# Altium schematic sheet [13] TYPEC0_PROG.SchDoc: Type C Programmer
size B; DocumentNumber: I; Revision: 01; SheetNumber: 13; SheetTotal: 19
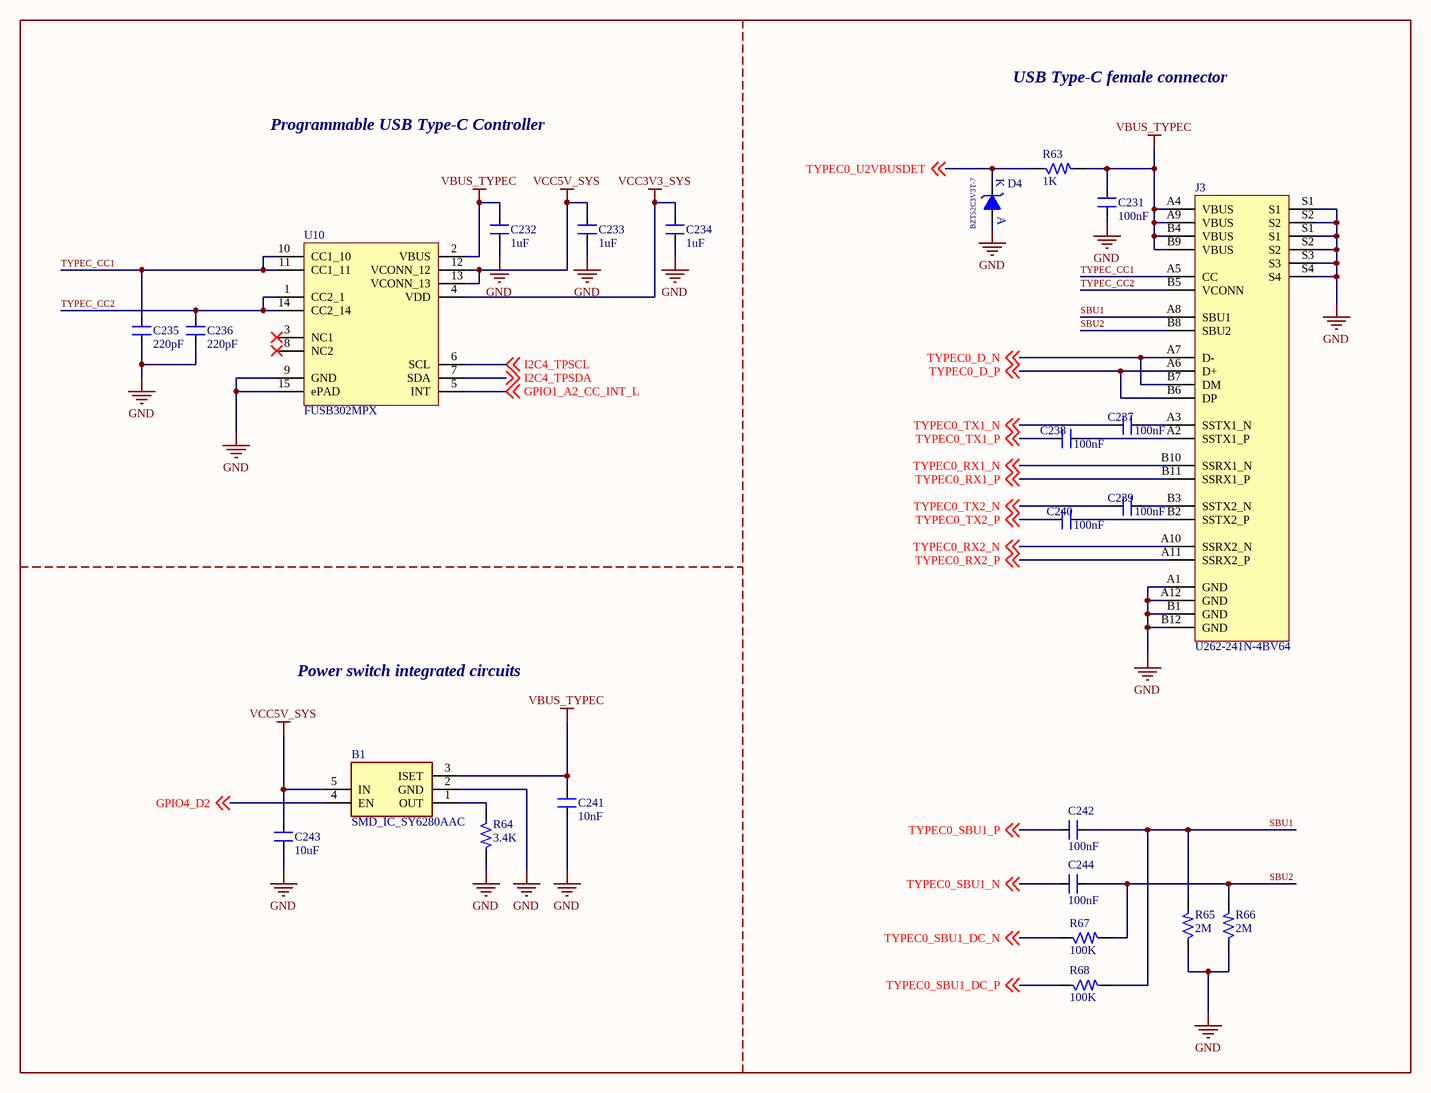
[diagram p0: [13] TYPEC0_PROG.SchDoc]

## Parts
B1  SMD_IC_SY6280AAC  [SOT95P285X140-5N]
C231  100nF  [CAP_0402]
C232  1uF  [CAP_0402]
C233  1uF  [CAP_0402]
C234  1uF  [CAP_0402]
C235  220pF  [CAP_0402]
C236  220pF  [CAP_0402]
C237  100nF  [CAP_0201]
C238  100nF  [CAP_0201]
C239  100nF  [CAP_0201]
C240  100nF  [CAP_0201]
C241  10nF  [CAP_0402]
C242  100nF  [CAP_0201]
C243  10uF  [CAP_0402]
C244  100nF  [CAP_0201]
D4  BZT52C3V3T-7  [DIO_SOD523]
J3  U262-241N-4BV64  [CON24_19.64_U262-241N-4BV64_TH_RA]
R63  1K  [RES_0402]
R64  3.4K  [RES_0402]
R65  2M  [RES_0201]
R66  2M  [RES_0201]
R67  100K  [RES_0201]
R68  100K  [RES_0201]
U10  FUSB302MPX  [MLP-14_98.4X98.4_SMD]

## Nets
GND: B1.2(GND) C231.1 C232.1 C233.2 C234.1 C235.1 C236.1 C241.1 C243.1 D4.A J3.A1(GND) J3.A12(GND) J3.B1(GND) J3.B12(GND) J3.S1 J3.S2 J3.S3 J3.S4 R64.2 R65.1 R66.1 U10.9(GND) U10.15(ePAD)
VBUS_TYPEC: B1.3(ISET) C231.2 C232.2 C241.2 J3.A4(VBUS) J3.A9(VBUS) J3.B4(VBUS) J3.B9(VBUS) R63.2 U10.2(VBUS)
VCC3V3_SYS: C234.2 U10.4(VDD)
VCC5V_SYS: B1.5(IN) C233.1 C243.2 U10.12(VCONN_12) U10.13(VCONN_13)
GPIO1_A2_CC_INT_L: U10.5(INT) ; off-sheet GPIO1_A2_CC_INT_L
GPIO4_D2: B1.4(EN) ; off-sheet GPIO4_D2
I2C4_TPSCL: U10.6(SCL) ; off-sheet I2C4_TPSCL
I2C4_TPSDA: U10.7(SDA) ; off-sheet I2C4_TPSDA
SBU1: C242.2 J3.A8(SBU1) R65.2 R68.2
SBU2: C244.2 J3.B8(SBU2) R66.2 R67.2
TYPEC0_D_N: J3.A7(D-) J3.B7(DM) ; off-sheet TYPEC0_D_N
TYPEC0_D_P: J3.A6(D+) J3.B6(DP) ; off-sheet TYPEC0_D_P
TYPEC0_RX1_N: J3.B10(SSRX1_N) ; off-sheet TYPEC0_RX1_N
TYPEC0_RX1_P: J3.B11(SSRX1_P) ; off-sheet TYPEC0_RX1_P
TYPEC0_RX2_N: J3.A10(SSRX2_N) ; off-sheet TYPEC0_RX2_N
TYPEC0_RX2_P: J3.A11(SSRX2_P) ; off-sheet TYPEC0_RX2_P
TYPEC0_SBU1_DC_N: R67.1 ; off-sheet TYPEC0_SBU1_DC_N
TYPEC0_SBU1_DC_P: R68.1 ; off-sheet TYPEC0_SBU1_DC_P
TYPEC0_SBU1_N: C244.1 ; off-sheet TYPEC0_SBU1_N
TYPEC0_SBU1_P: C242.1 ; off-sheet TYPEC0_SBU1_P
TYPEC0_TX1_N: C237.1 ; off-sheet TYPEC0_TX1_N
TYPEC0_TX1_P: C238.1 ; off-sheet TYPEC0_TX1_P
TYPEC0_TX2_N: C239.1 ; off-sheet TYPEC0_TX2_N
TYPEC0_TX2_P: C240.1 ; off-sheet TYPEC0_TX2_P
TYPEC0_U2VBUSDET: D4.K R63.1 ; off-sheet TYPEC0_U2VBUSDET
TYPEC_CC1: C235.2 J3.A5(CC) U10.10(CC1_10) U10.11(CC1_11)
TYPEC_CC2: C236.2 J3.B5(VCONN) U10.1(CC2_1) U10.14(CC2_14)
NetB1_1: B1.1(OUT) R64.1
NetC237_2: C237.2 J3.A3(SSTX1_N)
NetC238_2: C238.2 J3.A2(SSTX1_P)
NetC239_2: C239.2 J3.B3(SSTX2_N)
NetC240_2: C240.2 J3.B2(SSTX2_P)

Not connected (* = marked no-connect by the designer): U10 3(NC1)* 8(NC2)*

## Notes on the sheet
- USB Type-C female connector
- Programmable USB Type-C Controller
- Power switch integrated circuits
- Title
- Size:
- Date:
- B
- Number:
- Time:
- Revision:
- Sheet
- of
- File:

## Library data of the parts
B1 = SMD_IC_SY6280AAC: Power Switch ICs - Power Distribution; Manufacturer_Name: Olimex Ltd.; Manufacturer_Part_Number: SMD IC SY6280AAC; Geometry.Height: 1.4mm; Mouser Part Number: 909-SMDICSY6280AAC; Mouser Price/Stock: https://www.mouser.co.uk/ProductDetail/Olimex-Ltd/SMD-IC-SY6280AAC?qs=9vOqFld9vZUuwGiRcx8i5w%3D%3D; Datasheet Link: *
C231 = CAP_100nF-25V-10%-0402: 0.1µF ±10% 25V Ceramic Capacitor X7R 0402 (1005 Metric) /; Manufacturer: Walsin Technology Corporation; Manufacturer Part Number: 0402B104K250CT; Case/Package: 0402; Supplier-1: Digikey
C232-C234 = CAP_1uF-10V-10%-0402: 1µF ±10% 10V Ceramic Capacitor X6S 0402 (1005 Metric) /; Manufacturer: Murata Electronics; Manufacturer Part Number: GRT155C81A105KE01D; Case/Package: 0402; Supplier-1: Digikey
C235 C236 = CAP_220pF-10V-10%-0402: 220pF ±10% 10V Ceramic Capacitor X7R 0402 (1005 Metric) /; Manufacturer: KEMET; Manufacturer Part Number: C0402C221K8RAC7867; Case/Package: 0402; Supplier-1: Digikey
C237-C240 C242 C244 = CAP_100nF-25V-10%-0201: 0.1µF ±10% 25V Ceramic Capacitor X5R 0201 (0603 Metric) /; Manufacturer: TDK Corporation; Manufacturer Part Number: C0603X5R1E104K030BB; Case/Package: 0201; Supplier-1: Digikey
C241 = CAP_10nF-10V-10%-0402: 10000pF ±10% 10V Ceramic Capacitor X7R 0402 (1005 Metric) /; Manufacturer: AVX Corporation; Manufacturer Part Number: 0402ZC103KAT2A; Case/Package: 0402; Supplier-1: Digikey
C243 = CAP_10uF-10V-20%-0402: 10µF ±20% 10V Ceramic Capacitor X5R 0402 (1005 Metric) /; Manufacturer Part Number: CL05A106MP5NUNC; Manufacturer: Samsung Electro-Mechanics; Case/Package: 0402; Supplier-1: Digikey
D4 = DIO-Z_3.3V-300mW-SOD-523: Zener Diode 3.3V 300mW ±6% Surface Mount SOD-523 /; Manufacturer: Diodes Incorporated; Manufacturer Part Number: BZT52C3V3T-7; Case/Package: SOD523; Supplier-1: Digikey
J3 = CON-TYPEC_U262-241N-4BV64-SMD: USB - Type C Female 24 SMD USB Connectors RoHS; Manufacturer: XKB Connectivity; Manufacturer Part Number: U262-241N-4BV64; Case/Package: SMD; Supplier-1: LCSC
R63 = RES_1K-0.1W-1%-0402: 1 kOhms ±1% 0.1W, 1/10W Chip Resistor 0402 (1005 Metric) Anti-Sulfur Thin Film /; Manufacturer: Vishay Beyschlag/Draloric/BC Components; Manufacturer Part Number: MCS04020C1001FE000; Case/Package: 0402; Supplier-1: Digikey
R64 = RES_3.4K-0.1W-1%-0402: 3.4 kOhms ±1% 0.1W, 1/10W Chip Resistor 0402 (1005 Metric) Automotive AEC-Q200 Thick Film /; Manufacturer: Panasonic Electronic Components; Manufacturer Part Number: ERJ-2RKF3401X; Case/Package: 0402; Supplier-1: Digikey
R65 R66 = RES_2M-0.05W-1%-0201: 2 MOhms ±1% 0.05W, 1/20W Chip Resistor 0201 (0603 Metric) Thick Film /; Manufacturer: Yageo; Manufacturer Part Number: RC0201FR-072ML; Case/Package: 0201; Supplier-1: Digikey
R67 R68 = RES_100K-0.05W-1%-0201: 100 kOhms ±1% 0.05W, 1/20W Chip Resistor 0201 (0603 Metric) Automotive AEC-Q200 Thick Film /; Manufacturer: Panasonic Electronic Components; Manufacturer Part Number: ERJ-1GNF1003C; Case/Package: 0201; Supplier-1: Digikey
U10 = IC_FUSB302MPX: USB Controller USB 3.1 USB Interface 14-MLP (2.5x2.5); Manufacturer: ON Semiconductor; Manufacturer Part Number: FUSB302MPX; Case/Package: 14-MLP; Supplier-1: Digikey